# Altium schematic sheet zero.SchDoc
size A
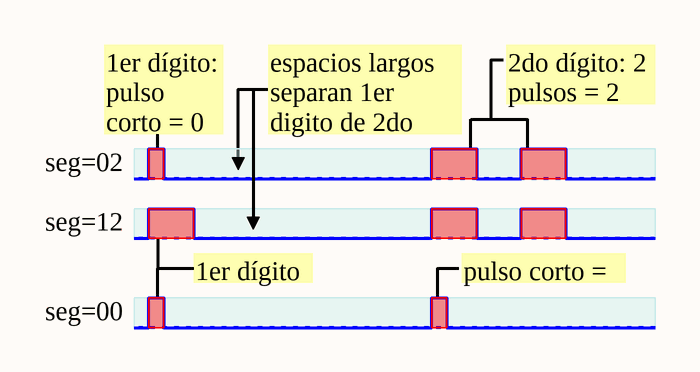
[diagram p0: zero.SchDoc]

## Notes on the sheet
- 1er dígito: pulso corto = 0
- espacios largos separan 1er digito de 2do digito
- 2do dígito: 2 pulsos = 2
- seg=02
- seg=12
- 1er dígito
- pulso corto = 0
- seg=00